# EasyEDA schematic Ampli audio.json
TITLE: Sheet_1; REV: 1.0; Date: 2024-02-19; Sheet: 1/1; Company: Your Company
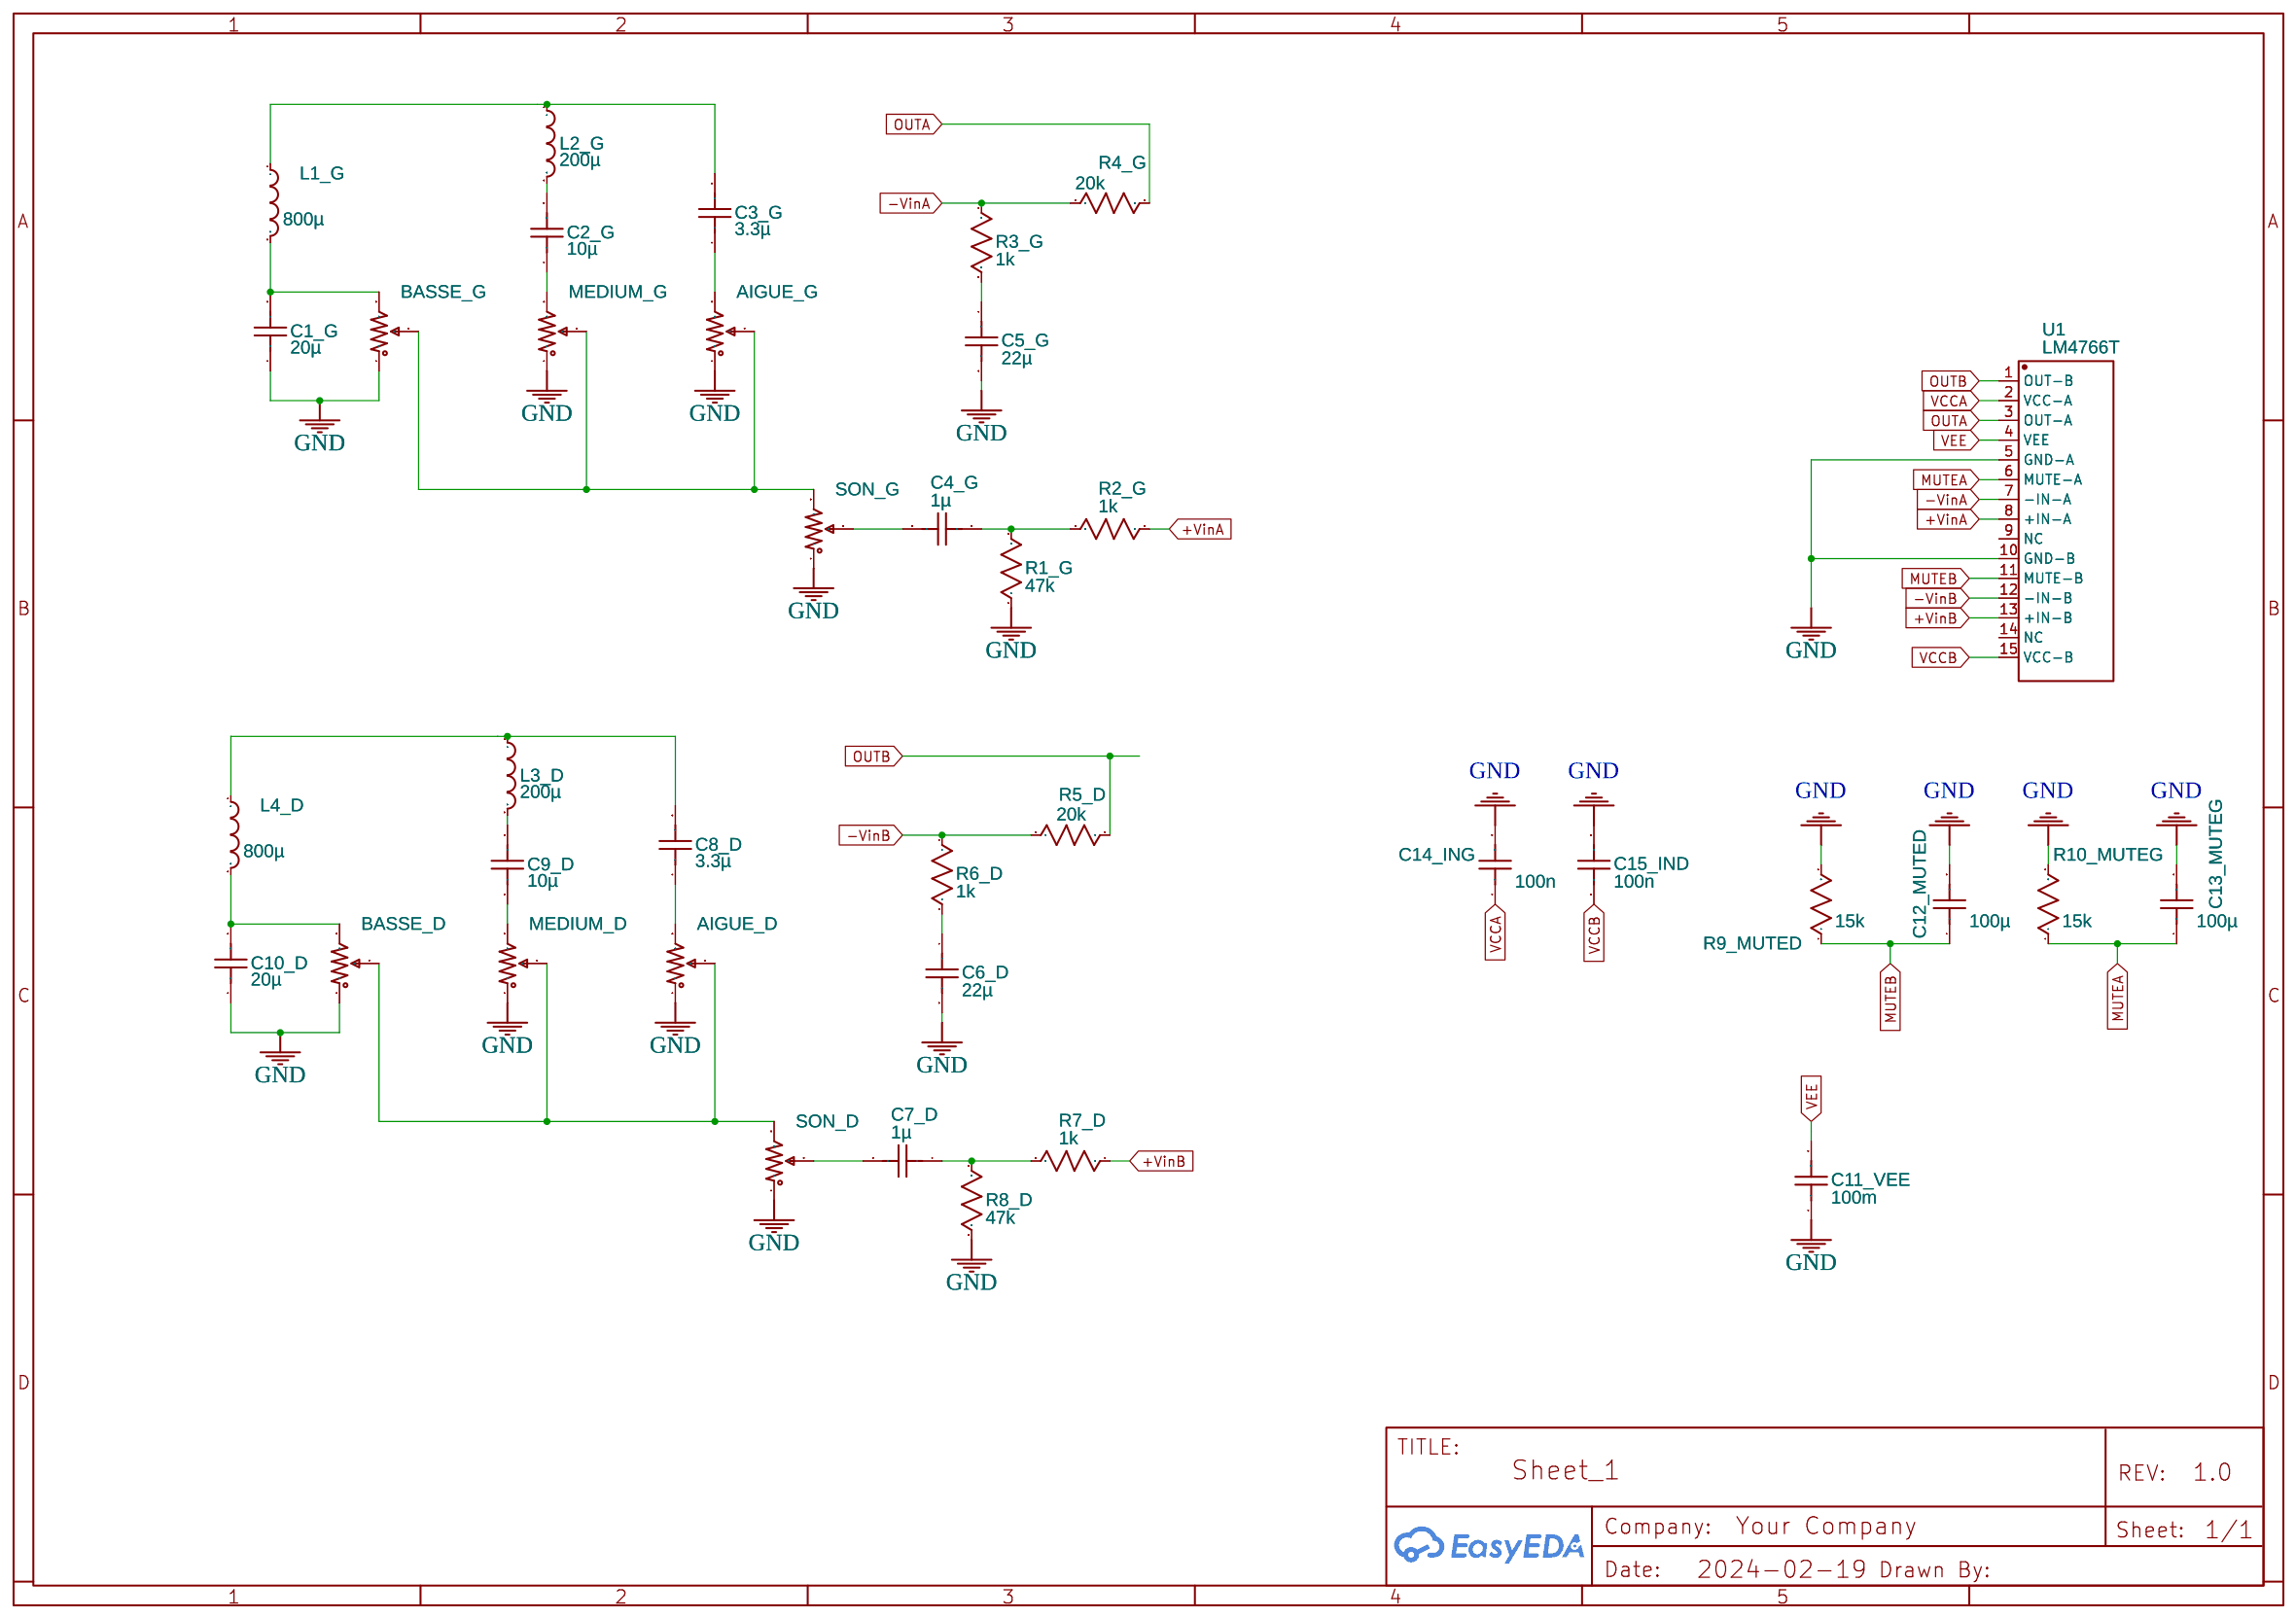
[diagram p0: schematic sheet]

## Parts
AIGUE_D  R_3386P_US  [RES-ADJ-TH_3386P]
AIGUE_G  R_3386P_US  [RES-ADJ-TH_3386P]
BASSE_D  R_3386P_US  [RES-ADJ-TH_3386P]
BASSE_G  R_3386P_US  [RES-ADJ-TH_3386P]
C1_G  20µ  [C0603]
C2_G  10µ  [C0603]
C3_G  3.3µ  [C0603]
C4_G  1µ  [C0603]
C5_G  22µ  [C0603]
C6_D  22µ  [C0603]
C7_D  1µ  [C0603]
C8_D  3.3µ  [C0603]
C9_D  10µ  [C0603]
C10_D  20µ  [C0603]
C11_VEE  100m  [C0603]
C12_MUTED  100µ  [C0603]
C13_MUTEG  100µ  [C0603]
C14_ING  100n  [C0603]
C15_IND  100n  [C0603]
L1_G  800µ  [L0603]
L2_G  200µ  [L0603]
L3_D  200µ  [L0603]
L4_D  800µ  [L0603]
MEDIUM_D  R_3386P_US  [RES-ADJ-TH_3386P]
MEDIUM_G  R_3386P_US  [RES-ADJ-TH_3386P]
R1_G  47k  [R0603]
R2_G  1k  [R0603]
R3_G  1k  [R0603]
R4_G  20k  [R0603]
R5_D  20k  [R0603]
R6_D  1k  [R0603]
R7_D  1k  [R0603]
R8_D  47k  [R0603]
R9_MUTED  15k  [R0603]
R10_MUTEG  15k  [R0603]
SON_D  R_3386P_US  [RES-ADJ-TH_3386P]
SON_G  R_3386P_US  [RES-ADJ-TH_3386P]
U1  LM4766T  [TO-220-15_L20.0-W4.50-P1.27-BL]

## Library data of the parts
AIGUE_D AIGUE_G BASSE_D BASSE_G MEDIUM_D MEDIUM_G SON_D SON_G = R_3386P_US: Supplier: LCSC; Contributor: LCEDA_Lib; value(Ω): 10K
C1_G C2_G C3_G C4_G C5_G C6_D C7_D C8_D C9_D C10_D C11_VEE C12_MUTED C13_MUTEG C14_ING C15_IND = C_0603_US: Contributor: LCEDA_Lib
L1_G L2_G L3_D L4_D = L0603_US: Contributor: LCEDA_Lib
R1_G R2_G R3_G R4_G R5_D R6_D R7_D R8_D R9_MUTED R10_MUTEG = R_0603_US: Contributor: LCEDA_Lib
U1 = LM4766T: Supplier Part: C9410; Supplier: LCSC; Manufacturer: TI(德州仪器); Manufacturer Part: LM4766T/NOPB; JLCPCB Part Class: Extended Part; link: https://lcsc.com/eda_search?q=C9410&%26type=1&ref=editor

## Nets
+VinA: R2_G.1 U1.8(+IN-A)
+VinB: R7_D.1 U1.13(+IN-B)
-VinA: R3_G.1 R4_G.1 U1.7(-IN-A)
-VinB: R5_D.1 R6_D.1 U1.12(-IN-B)
GND: AIGUE_D.1 AIGUE_G.1 BASSE_D.1 BASSE_G.1 C1_G.1 C5_G.2 C6_D.2 C10_D.1 C11_VEE.1 C12_MUTED.2 C13_MUTEG.2 C14_ING.2 C15_IND.2 MEDIUM_D.1 MEDIUM_G.1 R1_G.1 R8_D.1 R9_MUTED.2 R10_MUTEG.2 SON_D.1 SON_G.1 U1.5(GND-A) U1.10(GND-B)
VCCA: C14_ING.1 U1.2(VCC-A)
VCCB: C15_IND.1 U1.15(VCC-B)
VEE: C11_VEE.2 U1.4(VEE)
MUTEA: C13_MUTEG.1 R10_MUTEG.1 U1.6(MUTE-A)
MUTEB: C12_MUTED.1 R9_MUTED.1 U1.11(MUTE-B)
OUTA: R4_G.2 U1.3(OUT-A)
OUTB: R5_D.2 U1.1(OUT-B)
Net-(AIGUE_D-2): AIGUE_D.2 BASSE_D.2 MEDIUM_D.2 SON_D.3
Net-(AIGUE_D-3): AIGUE_D.3 C8_D.1
Net-(AIGUE_G-2): AIGUE_G.2 BASSE_G.2 MEDIUM_G.2 SON_G.3
Net-(AIGUE_G-3): AIGUE_G.3 C3_G.1
Net-(BASSE_D-3): BASSE_D.3 C10_D.2 L4_D.2
Net-(BASSE_G-3): BASSE_G.3 C1_G.2 L1_G.2
Net-(C2_G-1): C2_G.1 MEDIUM_G.3
Net-(C2_G-2): C2_G.2 L2_G.2
Net-(C3_G-2): C3_G.2 L1_G.1 L2_G.1
Net-(C4_G-1): C4_G.1 R1_G.2 R2_G.2
Net-(C4_G-2): C4_G.2 SON_G.2
Net-(C5_G-1): C5_G.1 R3_G.2
Net-(C6_D-1): C6_D.1 R6_D.2
Net-(C7_D-1): C7_D.1 R7_D.2 R8_D.2
Net-(C7_D-2): C7_D.2 SON_D.2
Net-(C8_D-2): C8_D.2 L3_D.1 L4_D.1
Net-(C9_D-1): C9_D.1 MEDIUM_D.3
Net-(C9_D-2): C9_D.2 L3_D.2

Not connected (* = marked no-connect by the designer): U1 9(NC) 14(NC)
